# Altium schematic sheet 12-USB Phy.SchDoc
size C; SheetNumber: 12; SheetTotal: 22
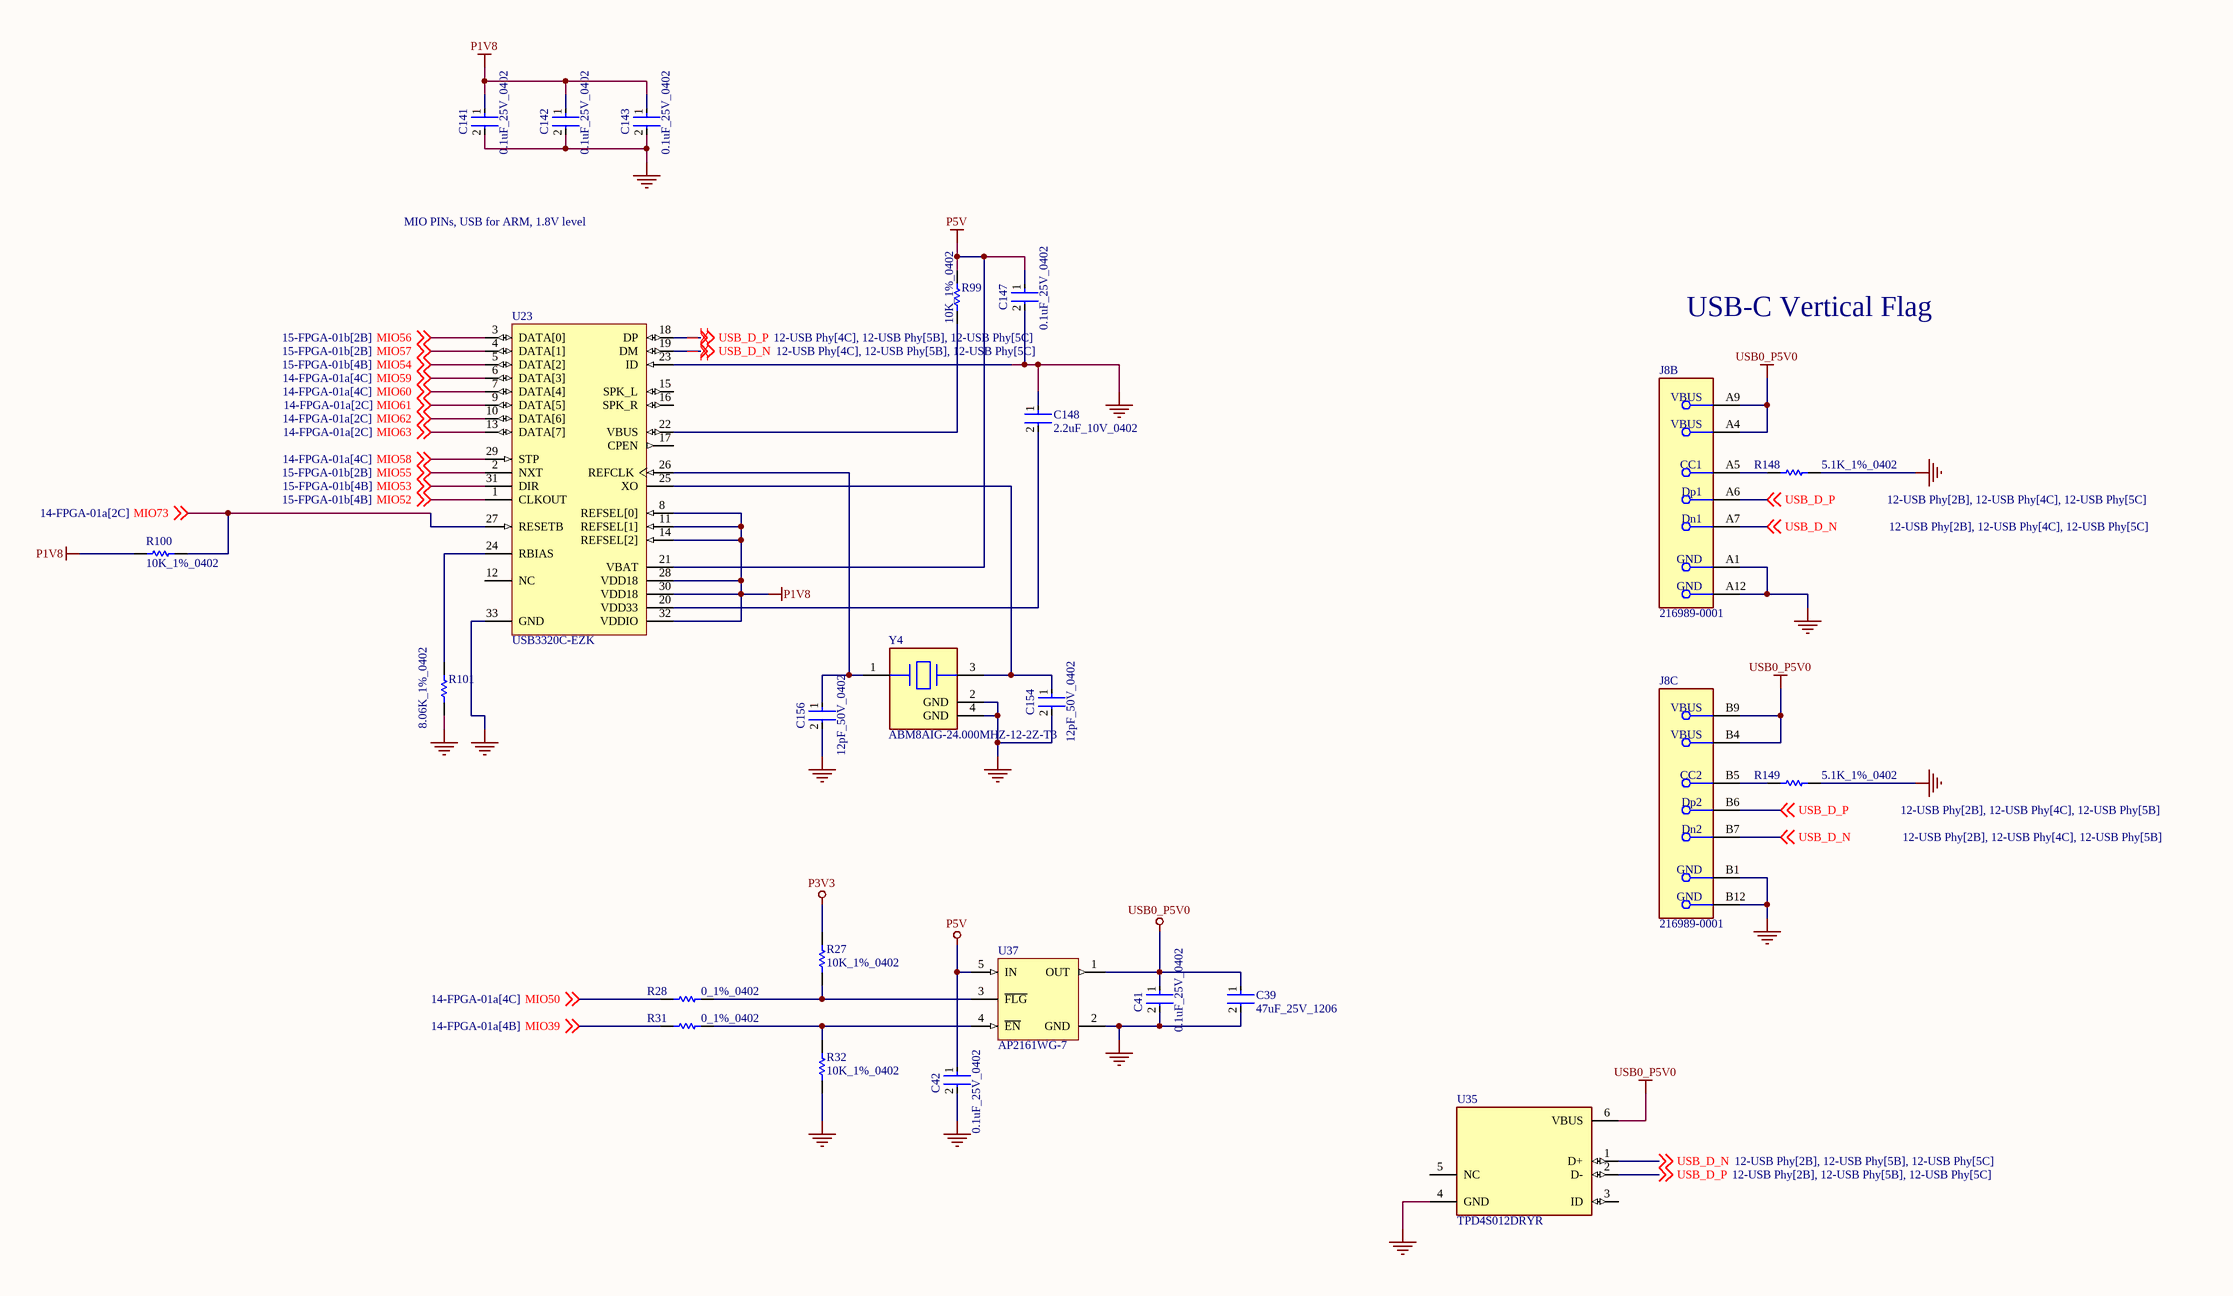
[diagram p0: 12-USB Phy.SchDoc]

## Parts
C39  47uF_25V_1206  [FP-C3216-160-0_2-MFG]
C41  0.1uF_25V_0402  [FP-0402-L_1_0_1-W_0_5_0_1-IPC_C]
C42  0.1uF_25V_0402  [FP-0402-L_1_0_1-W_0_5_0_1-IPC_C]
C141  0.1uF_25V_0402  [FP-0402-L_1_0_1-W_0_5_0_1-IPC_C]
C142  0.1uF_25V_0402  [FP-0402-L_1_0_1-W_0_5_0_1-IPC_C]
C143  0.1uF_25V_0402  [FP-0402-L_1_0_1-W_0_5_0_1-IPC_C]
C147  0.1uF_25V_0402  [FP-0402-L_1_0_1-W_0_5_0_1-IPC_C]
C148  2.2uF_10V_0402  [FP-C1005-050-0_15-0_1-MFG]
C154  12pF_50V_0402  [FP-0402-L_1_0_1-W_0_5_0_1-IPC_B]
C156  12pF_50V_0402  [FP-0402-L_1_0_1-W_0_5_0_1-IPC_B]
J8  216989-0001  [FP-216989-0001-MFG]  (parts B,C of 3)
R27  10K_1%_0402  [RESC1005X40X25NL10T10]
R28  0_1%_0402  [RESC1005X40X25LL05T05]
R31  0_1%_0402  [RESC1005X40X25LL05T05]
R32  10K_1%_0402  [RESC1005X40X25NL10T10]
R99  10K_1%_0402  [RESC1005X40X25NL10T10]
R100  10K_1%_0402  [RESC1005X40X25NL10T10]
R101  8.06K_1%_0402  [RESC1005X40X25ML05T05]
R148  5.1K_1%_0402  [RESC1005X40X25ML10T10]
R149  5.1K_1%_0402  [RESC1005X40X25ML10T10]
U23  USB3320C-EZK  [MCHP-QFN-32-5x5_V2]
U35  TPD4S012DRYR  [FP-DRY0006A-MFG]
U37  AP2161WG-7  [DIOD-SOT25-5_V]
Y4  ABM8AIG-24.000MHZ-12-2Z-T3  [FP-ABM8AIG-MFG]

## Nets
GND: C39.2 C41.2 C42.2 C141.2 C142.2 C143.2 C147.2 C148.1 C154.2 C156.2 J8.A1(GND) J8.A12(GND) J8.B1(GND) J8.B12(GND) R32.1 R101.1 R148.2 R149.2 U23.23(ID) U23.33(GND) U35.4(GND) U37.2(GND) Y4.2(GND) Y4.4(GND)
P1V8: C141.1 C142.1 C143.1 R100.1 U23.8(REFSEL[0]) U23.11(REFSEL[1]) U23.14(REFSEL[2]) U23.28(VDD18) U23.30(VDD18) U23.32(VDDIO)
P3V3: R27.2
P5V: C42.1 C147.1 R99.2 U23.21(VBAT) U37.5(IN)
USB0_P5V0: C39.1 C41.1 J8.A4(VBUS) J8.A9(VBUS) J8.B4(VBUS) J8.B9(VBUS) U35.6(VBUS) U37.1(OUT)
MIO39: R31.1 ; off-sheet MIO39
MIO50: R28.1 ; off-sheet MIO50
MIO52: U23.1(CLKOUT) ; off-sheet MIO52
MIO53: U23.31(DIR) ; off-sheet MIO53
MIO54: U23.5(DATA[2]) ; off-sheet MIO54
MIO55: U23.2(NXT) ; off-sheet MIO55
MIO56: U23.3(DATA[0]) ; off-sheet MIO56
MIO57: U23.4(DATA[1]) ; off-sheet MIO57
MIO58: U23.29(STP) ; off-sheet MIO58
MIO59: U23.6(DATA[3]) ; off-sheet MIO59
MIO60: U23.7(DATA[4]) ; off-sheet MIO60
MIO61: U23.9(DATA[5]) ; off-sheet MIO61
MIO62: U23.10(DATA[6]) ; off-sheet MIO62
MIO63: U23.13(DATA[7]) ; off-sheet MIO63
MIO73: R100.2 U23.27(RESETB) ; off-sheet MIO73
USB_D_N: J8.A7(Dn1) J8.B7(Dn2) U23.19(DM) U35.1(D+) ; off-sheet USB_D_N
USB_D_P: J8.A6(Dp1) J8.B6(Dp2) U23.18(DP) U35.2(D-) ; off-sheet USB_D_P
NetC148_2: C148.2 U23.20(VDD33)
NetC154_1: C154.1 U23.25(XO) Y4.3
NetC156_1: C156.1 U23.26(REFCLK) Y4.1
NetJ8_A5: J8.A5(CC1) R148.1
NetJ8_B5: J8.B5(CC2) R149.1
NetR27_1: R27.1 R28.2 U37.3(~{FLG})
NetR31_2: R31.2 R32.2 U37.4(~{EN})
NetR99_1: R99.1 U23.22(VBUS)
NetR101_2: R101.2 U23.24(RBIAS)

Not connected (* = marked no-connect by the designer): U23 12(NC) 15(SPK_L) 16(SPK_R) 17(CPEN); U35 3(ID) 5(NC)

## Layout directives
differential pair: USB_D_N, USB_D_P

## Notes on the sheet
- MIO PINs, USB for ARM, 1.8V level
- USB-C Vertical Flag

## Library data of the parts
C39 = CMP-2000-05397-3: Multilayer Ceramic Capacitors 47uF ±20% 25V X5R SMD 1206; Weight: 0.000571oz; Dielectric: X5R; Length: 0.126inch; Voltage Rating: 25V; Case/Package: 1206; Dielectric Material: Ceramic; Min Operating Temperature: -55°C; Lead Free: Lead Free; Packaging: Tape and Reel; Package Quantity: 1; Mount: Surface Mount; Depth: 1.6mm; REACH SVHC: No SVHC; Termination: SMD/SMT; Case Code (Imperial): 1206; Series: C; Resistor Type: Ceramic; Voltage: 25V; Width: 0.063inch; Height: 1.6mm; Tolerance: 20%; Capacitance: 47uF; Max Operating Temperature: 85°C; Voltage Rating (DC): 25V; RoHS Compliant: Yes; Thickness: 0.071inch; Case Code (Metric): 3216
C41 C42 C141-C143 C147 = CMP-2008-02519-2: General Purpose Ceramic Capacitor, 0402, 100nF, 10%, X7R, 15%, 25V; Package Quantity: 1; Capacitance: 100nF; Min Operating Temperature: -55°C; Voltage: 25V; Voltage Rating: 25V; Construction: Flat; Max Operating Temperature: 125°C; Radiation Hardening: No; Depth: 0.5mm; Thickness: 0.022inch; Voltage Rating (DC): 25V; Number of Pins: 2; Lead Free: Lead Free; Series: -; REACH SVHC: No SVHC; Length: 1mm; Dielectric: X7R; RoHS Compliant: Yes; Mount: Surface Mount; Packaging: Tape and Reel; Case/Package: 0402; Case Code (Imperial): 0402; Termination: SMD/SMT; Width: 0.02inch; Case Code (Metric): 1005; Tolerance: 10%
C148 = CMP-08246-004344-1: CAP CER 2.2UF 10V X7S 0402; Dielectric Material: Ceramic; Tolerance: 10%; Mount: Surface Mount; Height: 0.5mm; Package Quantity: 1; Depth: 0.5mm; RoHS Compliant: Yes; Length: 1mm; Thickness: 0.022inch; Packaging: Tape and Reel; Capacitance: 2.2uF; Case Code (Imperial): 0402; Resistor Type: Ceramic; Dielectric: X7S; Case/Package: 0402; Min Operating Temperature: -55°C; Voltage Rating: 10V; Series: C; Weight: 2.3E-05oz; Width: 0.02inch; Voltage Rating (DC): 10V; Case Code (Metric): 1005; Max Operating Temperature: 125°C; Termination: SMD/SMT; Lead Free: Lead Free
C154 C156 = CMP-2008-02574-2: General Purpose Ceramic Capacitor, 0402, 12pF, 5%, C0G, 30ppm/°C, 50V; Insulation Resistance: 100GR; Radiation Hardening: No; RoHS Compliant: Yes; Voltage Rating: 50V; Case Code (Imperial): 0402; Height: 0.5mm; Voltage: 50V; Voltage Rating (DC): 50V; Mount: Surface Mount; Capacitance: 12pF; Thickness: 0.022inch; Depth: 0.5mm; Max Operating Temperature: 125°C; Construction: Flat; Termination: SMD/SMT; Tolerance: 5%; Length: 1mm; Lead Free: Lead Free; Dielectric: C0G; Number of Pins: 2; Package Quantity: 1; Series: -; Temperature Coefficient: 30ppm/°C; Min Operating Temperature: -55°C; Case/Package: 0402; Packaging: Tape and Reel; Case Code (Metric): 1005; Width: 0.02inch; REACH SVHC: No SVHC
J8 = CMP-04767-000020-1: CONN RCPT USB2.0 TYPE C 24POS RA
R27 R32 R99 R100 = CMP-2002-04694-1: Manufacturer: Bourns; Part Number: CR0402-FX-1002GLF
R28 R31 = CMP-2000-07451-1: Chip Resistor, 0 Ohm, 0.1 W, -55 to 155 degC, 0402 (1005 Metric), RoHS, Tape and Reel; Manufacturer: Panasonic; Voltage Rating (DC): 50V; Temperature Coefficient: 600ppm/��C; Max Power Dissipation: 100mW; Resistance: 0mOhm; Tolerance: 5%; Number of Terminations: 2; Mount: SurfaceMount; Height: 0.35mm; Packaging: TapeandReel; Contact Plating: Tin; Manufacturer URL: http://www.panasonic.com/; Composition: ThickFilm; Max Operating Temperature: 155degC; REACH SVHC: NoSVHC; Case/Package: 0402; Package Reference: 402; Depth: 0.5mm; Package Description: 2-Pin Surface Mount Device, Body 1 x 0.5 mm; Datasheet URL: https://industrial.panasonic.com/cdbs/www-data/pdf/RDA0000/AOA0000C301.pdf; RoHSCompliant: True; Case Code (Imperial): 0402; Military Standard: Not; Min Operating Temperature: -55degC; Power Rating: 100mW; Datasheet Version: 03/2015; Length: 1mm; Case Code (Metric): 1005; Termination: SMD/SMT; Mounting Technology: SurfaceMount; Voltage Rating: 50V; Width: 0.02inch; Package Quantity: 1; Lead Free: LeadFree; Radiation Hardening: No
R101 = CMP-2002-00253-3: Chip Resistor, 8.06 KOhm, +/- 1%, 63 mW, -55 to 155 degC, 0402 (1005 Metric), RoHS, Tape and Reel; PartNumber: CRCW04028K06FKED; Manufacturer: Basic Passives; Case\/Package: 0402; Power Rating: 63 mW; Voltage Rating: 50 V; PackageReference: 0402; Radiation Hardening: No; Package Quantity: 10000; Height: 0.35 mm; Packaging: Tape and Reel; Mount: Surface Mount; Length: 1 mm; Weight: 2.3E-05oz; Case Code (Metric): 1005; DatasheetVersion: 06/2012; Pins: 2; Min Operating Temperature: -55 degC; Case Code (Imperial): 0402; REACH SVHC: Unknown; Tolerance: 1%; Mounting Technology: Surface Mount; ComponentLink1URL: http://www.vishay.com/; ComponentLink2URL: http://www.vishay.com/docs/20035/dcrcwe3.pdf; ComponentLink2Description: Datasheet; Resistance: 8.06 KOhm; Max Operating Temperature: 155 degC; ComponentLink1Description: Manufacturer URL; Width: 0.5 mm; RoHSCompliant: true; PackageDescription: 2-Pin Surface Mount Device, Body 1 x 0.5 mm
R148 R149 = CMP-2002-04046-1: Manufacturer: KOA Speer; Part Number: RK73H1ETTP5101F
U23 = CMP-0186-00335-1: Highly Integrated Full Featured Hi-Speed USB 2.0 ULPI Transceiver, 1.8 to 3.3 V, -40 to 85 degC, 32-Pin QFN (QFN-3304), RoHS, Tray; Manufacturer: Microchip; VVBAT: 3.1 to 5.5 V; REFCLK Frequency@ULPI Input Clock Mode: 60 MHz; Cpin: 4 pF Max.; VDD33: 3 to 3.6 V; Mounting Technology: Surface Mount; I/O Voltage: 1.8 to 3.3 V; ComponentLink3URL: http://ww1.microchip.com/downloads/en/DeviceDoc/00001792A.pdf; PackageDescription: 32-Pin Quad Flat Non-Leaded Package, Body 5 x 5 mm, Pitch 0.5 mm; ComponentLink2URL: http://ww1.microchip.com/downloads/en/DeviceDoc/00001792A.pdf; Temperature Range: -40 to 85 degC; ComponentLink2Description: Datasheet; ComponentLink1URL: www.microchip.com/; ComponentLink3Description: Package Specification; Packing: Tray; ComponentLink1Description: Manufacturer URL; PartNumber: USB3320C-EZK; PackageVersion: Rev. H; DatasheetVersion: DS00001792A; RoHS: TRUE
U35 = CMP-0326-00038-4: TVS DIODE 5.5V 6SON; Breakdown Voltage: 24V; Interface: USB; ESD Protection: Yes; Peak Pulse Power: 60W; Number of Circuits: 4; Polarity: Unidirectional; Capacitance: 15pF; Test Current: 1mA; Working Voltage: 19V; Min Breakdown Voltage: 6V; Peak Pulse Current: 3A; Operating Supply Voltage: 950mV; Max Operating Temperature: 85°C; Packaging: Tape and Reel; Termination: SMD/SMT; Number of Pins: 6; Radiation Hardening: No; Width: 1.05mm; REACH SVHC: No SVHC; Lead Free: Lead Free; Depth: 1mm; Package Quantity: 5000; Length: 1.45mm; Direction: Unidirectional; Min Operating Temperature: -40°C; Number of Channels: 4; Max Power Dissipation: 60W; Height: 0.55mm
U37 = CMP-2000-05781-1: Single Channel Current-limited Power Switch / , 1 A, 2.7 to 5.5 V, -40 to 85 degC, 5-Pin SOT25, RoHS, Tape and Reel; Manufacturer: Diodes-Incorporated; Voltage - Supply (Vcc/Vdd): NotRequired; Interface: On/Off; Ratio - Input: Output:1:1; Input Type: Non-Inverting; Fault Protection: CurrentLimiting(Fixed),OverTemperature,ReverseCurrent,UVLO; Voltage - Load: 2.7V~5.5V; Number of Outputs: 1; Current - Output (Max): 1A; Output Configuration: HighSide; Output Type: P-Channel; Rds On (Typ): 95mOhm; Switch Type: USBSwitch; Family: PMIC-PowerDistributionSwitches,LoadDrivers; Package Reference: SOT25-5; Operating Temperature: -40°C~85°C(TA); Category: IntegratedCircuits(ICs); Datasheet URL: https://www.diodes.com/assets/Datasheets/AP2161_71.pdf; Manufacturer URL: http://www.diodes.com/; Package Description: 5-Pin Small Outline Transistor, Body 3 x 1.6 mm, Pitch 0.95 mm; Mounting Technology: SurfaceMount; Packaging: Tape&Reel(TR); Datasheet Version: Rev. 9-2, 08/2015; Supplier Device Package: SOT-25; Package / Case: SC-74A,SOT-753; Features: StatusFlag; Series: -
Y4 = CMP-27762-015716-1: Crystal 24MHz ±20ppm (Tol) ±50ppm (Stability) 12pF FUND 50Ω Automotive 4-Pin Ultra Mini-CSMD T/R; ESR (Equivalent Series Resistance): 50R; Series: ABM8AIG; RoHS Compliant: Yes; Load Capacitance: 12pF; Height: 0.031inch; Min Operating Temperature: -40°C; Mount: Surface Mount; Packaging: Cut Tape; Ratings: AEC-Q200; Case/Package: SMD/SMT; Frequency Stability: 50ppm; Max Operating Temperature: 125°C; Length: 0.126inch; Frequency: 24MHz; Frequency Tolerance: 20ppm; Width: 0.098inch